# EAGLE schematic mbed_programmer (EAGLE 7.5.0)

## Sheet 1 of 4
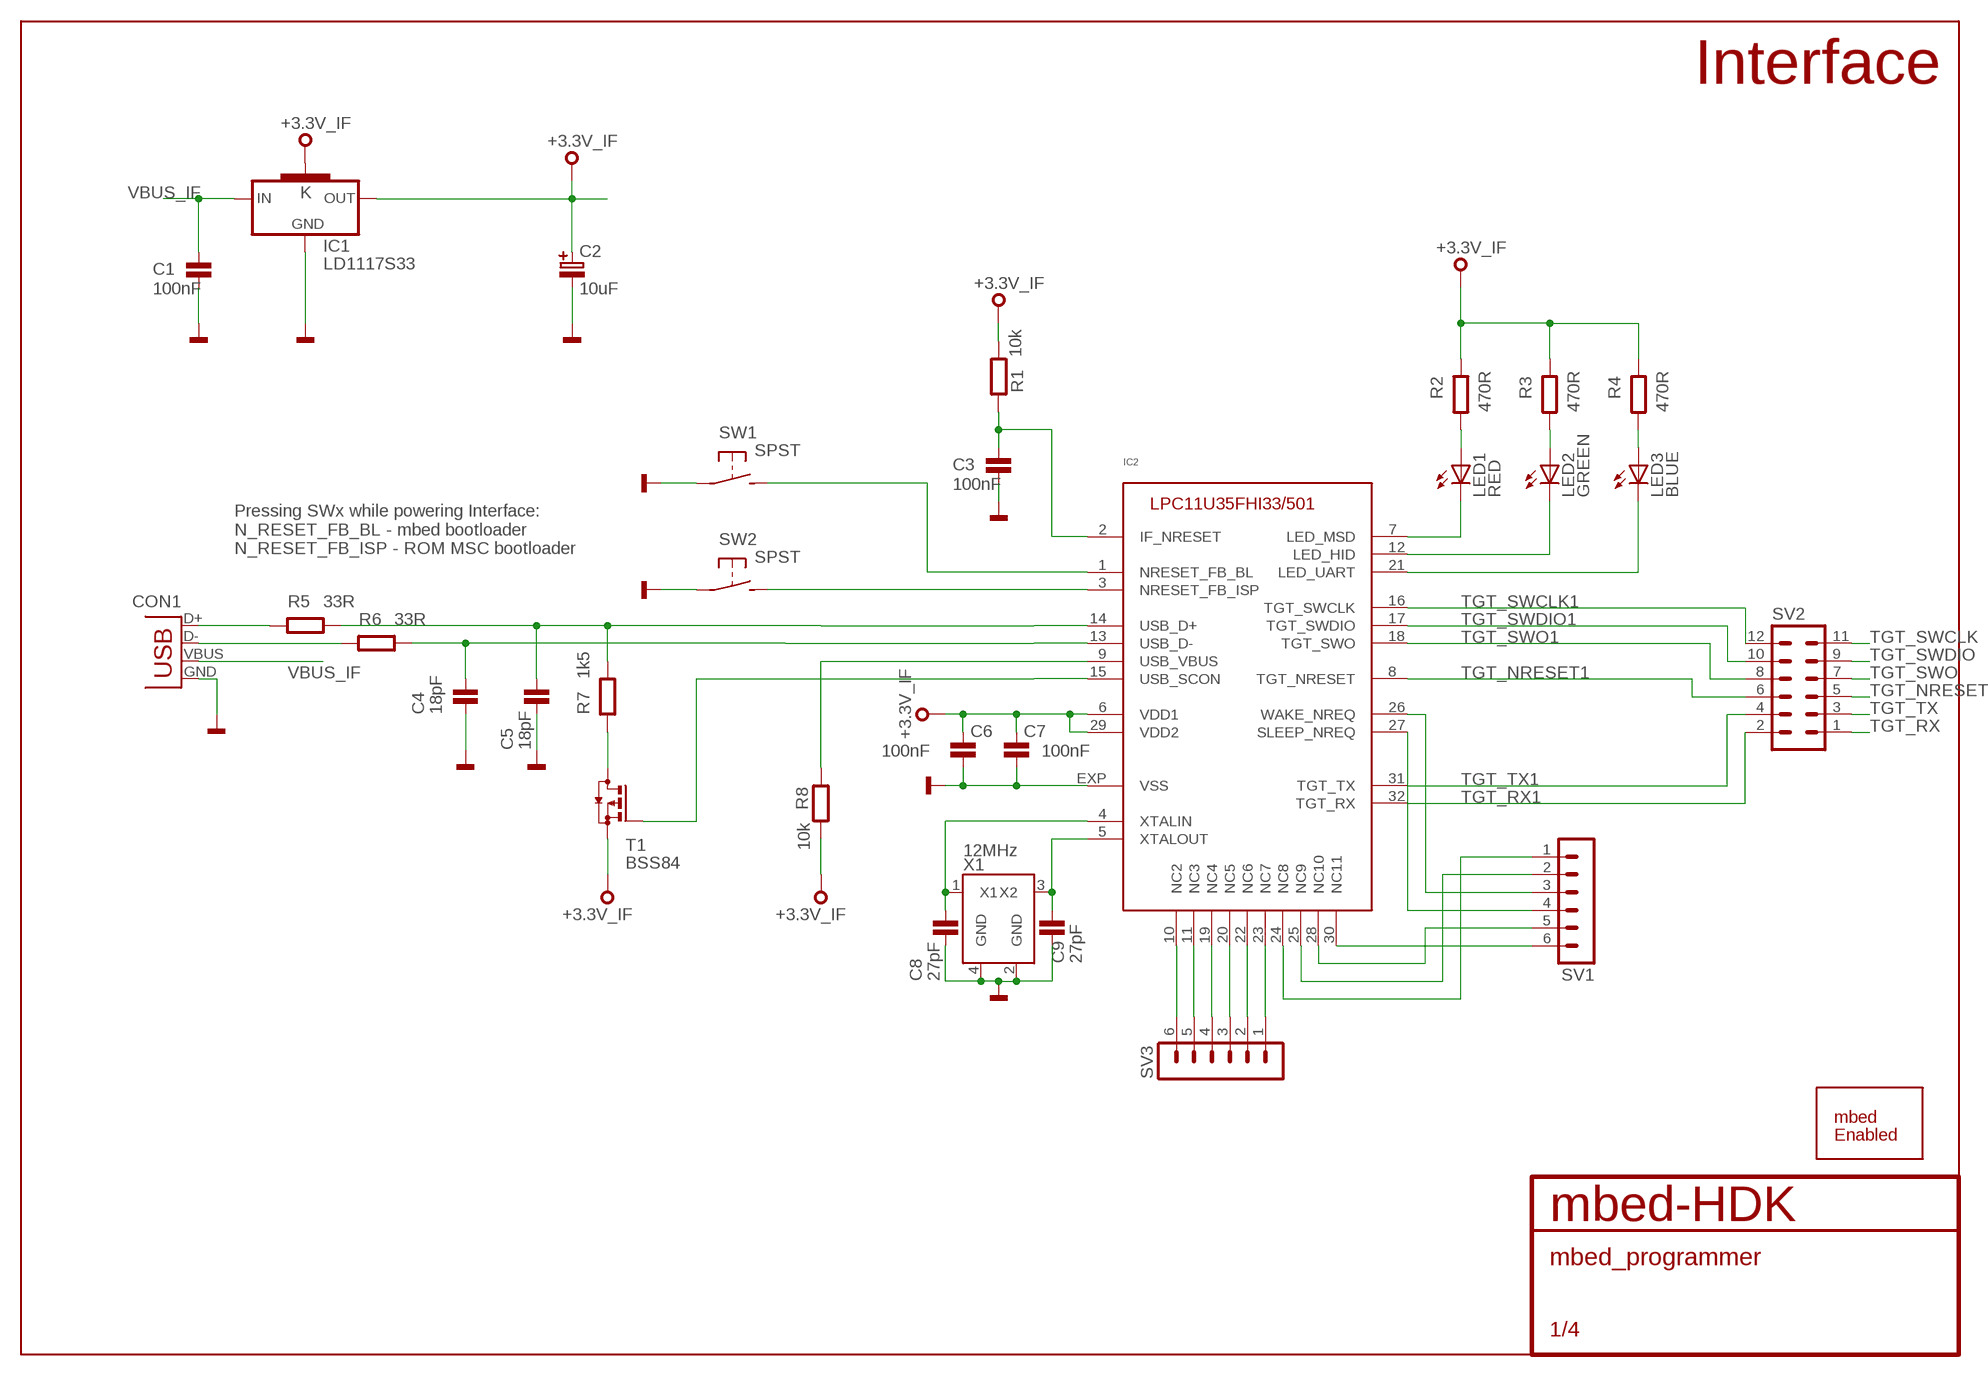
[diagram p0: schematic, sheet 1]

### Parts
C1  100nF  C0603  [0603]
C2  10uF  C-POLB  [CASE-B]
C3  100nF  C0603  [0603]
C4  18pF  C0603  [0603]
C5  18pF  C0603  [0603]
C6  100nF  C0603  [0603]
C7  100nF  C0603  [0603]
C8  27pF  C0603  [0603]
C9  27pF  C0603  [0603]
CON1  USB-MB-S  [USB-MB-S]
IC1  LD1117S33  [SOT223]
IC2  IF-LPC11U35  [HVQFN33]
LED1  RED  LED0603  [CHIPLED_0603]
LED2  GREEN  LED0603  [CHIPLED_0603]
LED3  BLUE  LED0603  [CHIPLED_0603]
R1  10k  R0603  [0603]
R2  470R  R0603  [0603]
R3  470R  R0603  [0603]
R4  470R  R0603  [0603]
R5  33R  R0603  [0603]
R6  33R  R0603  [0603]
R7  1k5  R0603  [0603]
R8  10k  R0603  [0603]
SS1  MBED-ENABLED-LOGOMEDIUM  [MBED-ENABLED-LOGO-500X500-MIL]
SV1  MA06-1  [MA06-1]
SV2  MA06-2  [MA06-2]
SV3  MA06-1  [MA06-1]
SW1  SPST  [DTSM-32S-B]
SW2  SPST  [DTSM-32S-B]
T1  BSS84  [SOT23]
X1  12MHz  ABM8  [OSC_CMD_32_25]

### Nets
+3.3V_IF: C2.1 C6.1 C7.1 IC1.2(OUT) IC1.4(K) IC2.6(VDD1) IC2.29(VDD2) R1.2 R2.1 R3.1 R4.1 R8.2 T1.2(S)
GND: C1.2 C2.2 C3.2 C4.2 C5.2 C6.2 C7.2 C8.2 C9.2 CON1.GND IC1.1(GND) IC2.EXP(VSS) SW1.P$1(P) SW2.P$1(P) X1.2(GND) X1.4(GND) ; also sheet 2,3
GREEN: IC2.12(LED_HID) LED2.C
GREEN1: IC2.7(LED_MSD) LED1.C
N$1: C5.1 IC2.14(USB_D+) R5.2 R7.2
N$2: C4.1 IC2.13(USB_D-) R6.2
N$3: CON1.D- R6.1
N$4: CON1.D+ R5.1
N$5: C3.1 IC2.2(IF_NRESET) R1.1
N$6: R7.1 T1.3(D)
N$7: IC2.9(USB_VBUS) R8.1
N$8: LED1.A R2.2
N$9: LED2.A R3.2
N$11: C8.1 IC2.4(XTALIN) X1.1(X1)
N$12: C9.1 IC2.5(XTALOUT) X1.3(X2)
N$13: IC2.21(LED_UART) LED3.C
N$15: IC2.1(NRESET_FB_BL) SW1.P$2(S)
N$17: IC2.3(NRESET_FB_ISP) SW2.P$2(S)
N$18: LED3.A R4.2
N$19: IC2.15(USB_SCON) T1.1(G)
N$79: IC2.30(NC11) SV1.6
N$80: IC2.28(NC10) SV1.5
N$81: IC2.27(SLEEP_NREQ) SV1.4
N$82: IC2.26(WAKE_NREQ) SV1.3
N$83: IC2.25(NC9) SV1.2
N$84: IC2.24(NC8) SV1.1
N$85: IC2.10(NC2) SV3.6
N$86: IC2.11(NC3) SV3.5
N$87: IC2.19(NC4) SV3.4
N$88: IC2.20(NC5) SV3.3
N$89: IC2.22(NC6) SV3.2
N$90: IC2.23(NC7) SV3.1
TGT_NRESET: SV2.5 ; also sheet 2
TGT_NRESET1: IC2.8(TGT_NRESET) SV2.6
TGT_RX: SV2.1 ; also sheet 2
TGT_RX1: IC2.32(TGT_RX) SV2.2
TGT_SWCLK: SV2.11 ; also sheet 2
TGT_SWCLK1: IC2.16(TGT_SWCLK) SV2.12
TGT_SWDIO: SV2.9 ; also sheet 2
TGT_SWDIO1: IC2.17(TGT_SWDIO) SV2.10
TGT_SWO: SV2.7 ; also sheet 2
TGT_SWO1: IC2.18(TGT_SWO) SV2.8
TGT_TX: SV2.3 ; also sheet 2
TGT_TX1: IC2.31(TGT_TX) SV2.4
VBUS_IF: C1.1 CON1.VBUS IC1.3(IN) ; also sheet 3

### Notes on the sheet
- Interface
- Pressing SWx while powering Interface:
  N_RESET_FB_BL - mbed bootloader
  N_RESET_FB_ISP - ROM MSC bootloader

## Sheet 2 of 4
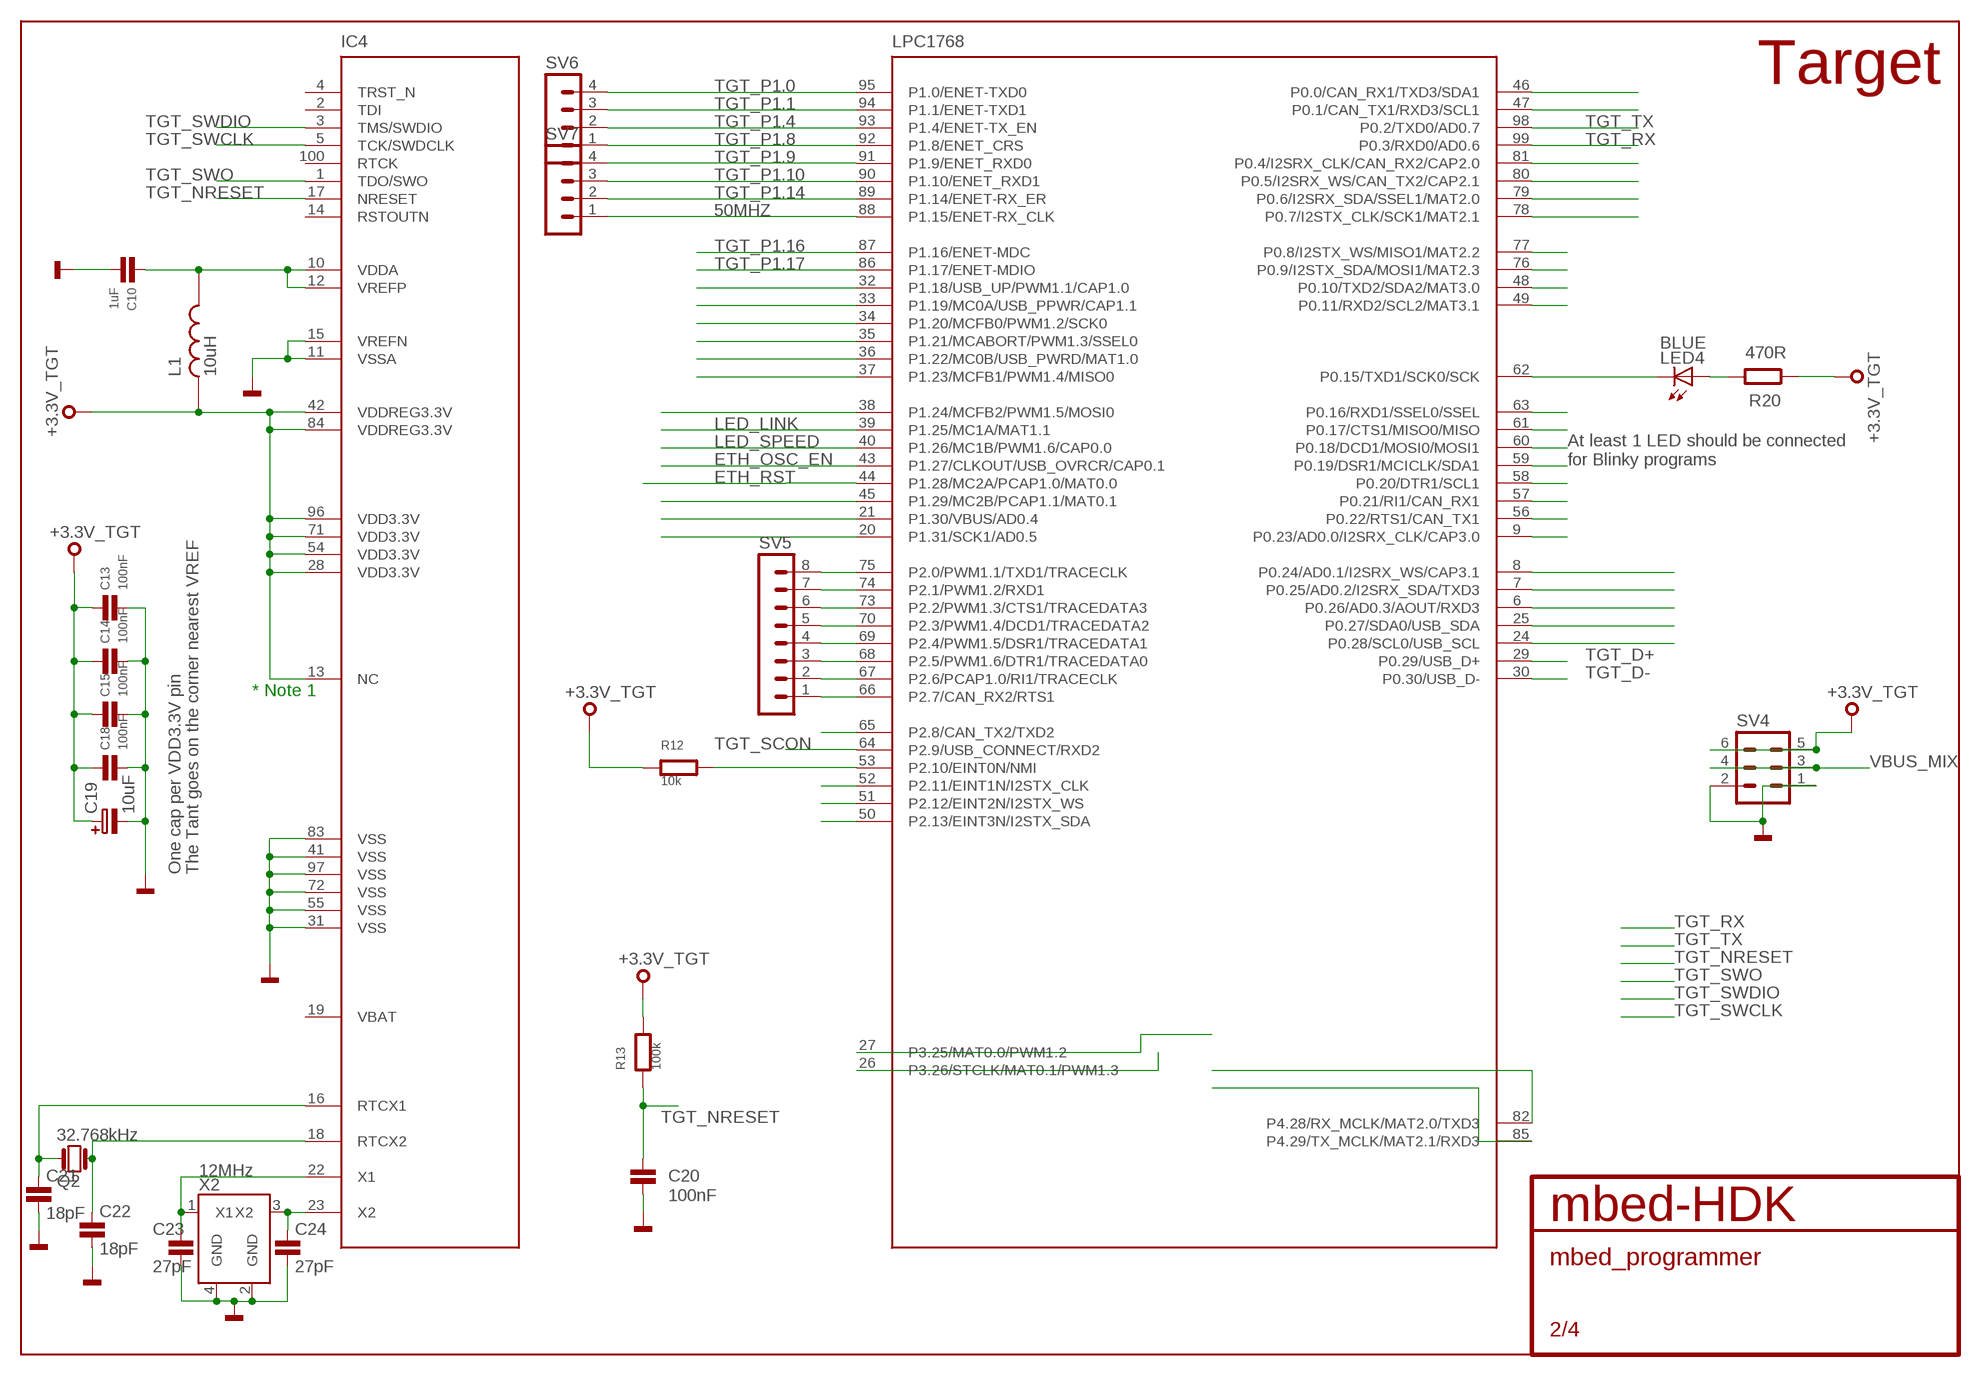
[diagram p1: schematic, sheet 2]

### Parts
C10  1uF  C0603  [0603]
C13  100nF  C0603  [0603]
C14  100nF  C0603  [0603]
C15  100nF  C0603  [0603]
C18  100nF  C0603  [0603]
C19  10uF  C-POLB  [CASE-B]
C20  100nF  C0603  [0603]
C21  18pF  C0603  [0603]
C22  18pF  C0603  [0603]
C23  27pF  C0603  [0603]
C24  27pF  C0603  [0603]
IC4  LPC1768  [LQFP100]
L1  10uH  L  [0603]
LED4  BLUE  LED0603  [CHIPLED_0603]
Q2  32.768kHz  Q_FC135  [FC135]
R12  10k  R0603  [0603]
R13  100k  R0603  [0603]
R20  470R  R0603  [0603]
SV4  MA03-2  [MA03-2]
SV5  MA08-1  [MA08-1]
SV6  MA04-1  [MA04-1]
SV7  MA04-1  [MA04-1]
X2  12MHz  ABM8  [OSC_CMD_32_25]

### Nets
50MHZ: IC4.88(P1.15/ENET-RX_CLK) SV7.1
+3.3V_TGT: C13.1 C14.1 C15.1 C18.1 C19.1 IC4.13(NC) IC4.28(VDD3.3V) IC4.42(VDDREG3.3V) IC4.54(VDD3.3V) IC4.71(VDD3.3V) IC4.84(VDDREG3.3V) IC4.96(VDD3.3V) L1.1 R12.1 R13.2 R20.1 SV4.5 SV4.6 ; also sheet 3
ETH_OSC_EN: IC4.43(P1.27/CLKOUT/USB_OVRCR/CAP0.1)
ETH_RST: IC4.44(P1.28/MC2A/PCAP1.0/MAT0.0)
GND: C10.2 C13.2 C14.2 C15.2 C18.2 C19.2 C20.1 C21.1 C22.1 C23.1 C24.1 IC4.11(VSSA) IC4.15(VREFN) IC4.31(VSS) IC4.41(VSS) IC4.55(VSS) IC4.72(VSS) IC4.83(VSS) IC4.97(VSS) SV4.1 SV4.2 X2.2(GND) X2.4(GND) ; also sheet 1,3
LED_LINK: IC4.39(P1.25/MC1A/MAT1.1)
LED_SPEED: IC4.40(P1.26/MC1B/PWM1.6/CAP0.0)
N$16: C10.1 IC4.10(VDDA) IC4.12(VREFP) L1.2
N$20: IC4.53(P2.10/EINT0N/NMI) R12.2
N$21: C23.2 IC4.22(X1) X2.1(X1)
N$23: C21.2 IC4.16(RTCX1) Q2.X2
N$24: C22.2 IC4.18(RTCX2) Q2.X1
N$25: IC4.62(P0.15/TXD1/SCK0/SCK) LED4.C
N$26: LED4.A R20.2
N$27: IC4.32(P1.18/USB_UP/PWM1.1/CAP1.0)
N$30: IC4.33(P1.19/MC0A/USB_PPWR/CAP1.1)
N$31: IC4.34(P1.20/MCFB0/PWM1.2/SCK0)
N$32: IC4.35(P1.21/MCABORT/PWM1.3/SSEL0)
N$33: IC4.36(P1.22/MC0B/USB_PWRD/MAT1.0)
N$34: IC4.37(P1.23/MCFB1/PWM1.4/MISO0)
N$35: IC4.38(P1.24/MCFB2/PWM1.5/MOSI0)
N$36: IC4.45(P1.29/MC2B/PCAP1.1/MAT0.1)
N$37: IC4.21(P1.30/VBUS/AD0.4)
N$38: IC4.20(P1.31/SCK1/AD0.5)
N$39: IC4.75(P2.0/PWM1.1/TXD1/TRACECLK) SV5.8
N$40: IC4.74(P2.1/PWM1.2/RXD1) SV5.7
N$41: IC4.73(P2.2/PWM1.3/CTS1/TRACEDATA3) SV5.6
N$42: IC4.70(P2.3/PWM1.4/DCD1/TRACEDATA2) SV5.5
N$43: IC4.69(P2.4/PWM1.5/DSR1/TRACEDATA1) SV5.4
N$44: IC4.68(P2.5/PWM1.6/DTR1/TRACEDATA0) SV5.3
N$45: IC4.67(P2.6/PCAP1.0/RI1/TRACECLK) SV5.2
N$46: IC4.66(P2.7/CAN_RX2/RTS1) SV5.1
N$47: IC4.65(P2.8/CAN_TX2/TXD2)
N$48: IC4.52(P2.11/EINT1N/I2STX_CLK)
N$49: IC4.51(P2.12/EINT2N/I2STX_WS)
N$50: IC4.50(P2.13/EINT3N/I2STX_SDA)
N$51: IC4.27(P3.25/MAT0.0/PWM1.2)
N$52: IC4.26(P3.26/STCLK/MAT0.1/PWM1.3)
N$53: IC4.82(P4.28/RX_MCLK/MAT2.0/TXD3)
N$54: IC4.85(P4.29/TX_MCLK/MAT2.1/RXD3)
N$55: IC4.24(P0.28/SCL0/USB_SCL)
N$56: IC4.25(P0.27/SDA0/USB_SDA)
N$57: IC4.6(P0.26/AD0.3/AOUT/RXD3)
N$58: IC4.7(P0.25/AD0.2/I2SRX_SDA/TXD3)
N$59: IC4.8(P0.24/AD0.1/I2SRX_WS/CAP3.1)
N$60: IC4.9(P0.23/AD0.0/I2SRX_CLK/CAP3.0)
N$61: IC4.56(P0.22/RTS1/CAN_TX1)
N$62: IC4.57(P0.21/RI1/CAN_RX1)
N$63: IC4.58(P0.20/DTR1/SCL1)
N$64: IC4.59(P0.19/DSR1/MCICLK/SDA1)
N$65: IC4.60(P0.18/DCD1/MOSI0/MOSI1)
N$66: IC4.61(P0.17/CTS1/MISO0/MISO)
N$67: IC4.63(P0.16/RXD1/SSEL0/SSEL)
N$68: IC4.49(P0.11/RXD2/SCL2/MAT3.1)
N$69: IC4.48(P0.10/TXD2/SDA2/MAT3.0)
N$70: IC4.76(P0.9/I2STX_SDA/MOSI1/MAT2.3)
N$71: IC4.77(P0.8/I2STX_WS/MISO1/MAT2.2)
N$72: IC4.78(P0.7/I2STX_CLK/SCK1/MAT2.1)
N$73: IC4.79(P0.6/I2SRX_SDA/SSEL1/MAT2.0)
N$74: IC4.80(P0.5/I2SRX_WS/CAN_TX2/CAP2.1)
N$75: IC4.81(P0.4/I2SRX_CLK/CAN_RX2/CAP2.0)
N$76: IC4.47(P0.1/CAN_TX1/RXD3/SCL1)
N$77: IC4.46(P0.0/CAN_RX1/TXD3/SDA1)
N$78: C24.2 IC4.23(X2) X2.3(X2)
TGT_D+: IC4.29(P0.29/USB_D+) ; also sheet 3
TGT_D-: IC4.30(P0.30/USB_D-) ; also sheet 3
TGT_NRESET: C20.2 IC4.17(NRESET) R13.1 ; also sheet 1
TGT_P1.0: IC4.95(P1.0/ENET-TXD0) SV6.4
TGT_P1.1: IC4.94(P1.1/ENET-TXD1) SV6.3
TGT_P1.4: IC4.93(P1.4/ENET-TX_EN) SV6.2
TGT_P1.8: IC4.92(P1.8/ENET_CRS) SV6.1
TGT_P1.9: IC4.91(P1.9/ENET_RXD0) SV7.4
TGT_P1.10: IC4.90(P1.10/ENET_RXD1) SV7.3
TGT_P1.14: IC4.89(P1.14/ENET-RX_ER) SV7.2
TGT_P1.16: IC4.87(P1.16/ENET-MDC)
TGT_P1.17: IC4.86(P1.17/ENET-MDIO)
TGT_RX: IC4.99(P0.3/RXD0/AD0.6) ; also sheet 1
TGT_SCON: IC4.64(P2.9/USB_CONNECT/RXD2) ; also sheet 3
TGT_SWCLK: IC4.5(TCK/SWDCLK) ; also sheet 1
TGT_SWDIO: IC4.3(TMS/SWDIO) ; also sheet 1
TGT_SWO: IC4.1(TDO/SWO) ; also sheet 1
TGT_TX: IC4.98(P0.2/TXD0/AD0.7) ; also sheet 1
VBUS_MIX: SV4.3 SV4.4 ; also sheet 3
Unconnected: IC4.2(TDI) IC4.4(TRST_N) IC4.14(RSTOUTN) IC4.19(VBAT) IC4.100(RTCK)

### Notes on the sheet
- Target
- At least 1 LED should be connected
  for Blinky programs
- * Note 1
- One cap per VDD3.3V pin | The Tant goes on the corner nearest VREF

## Sheet 3 of 4
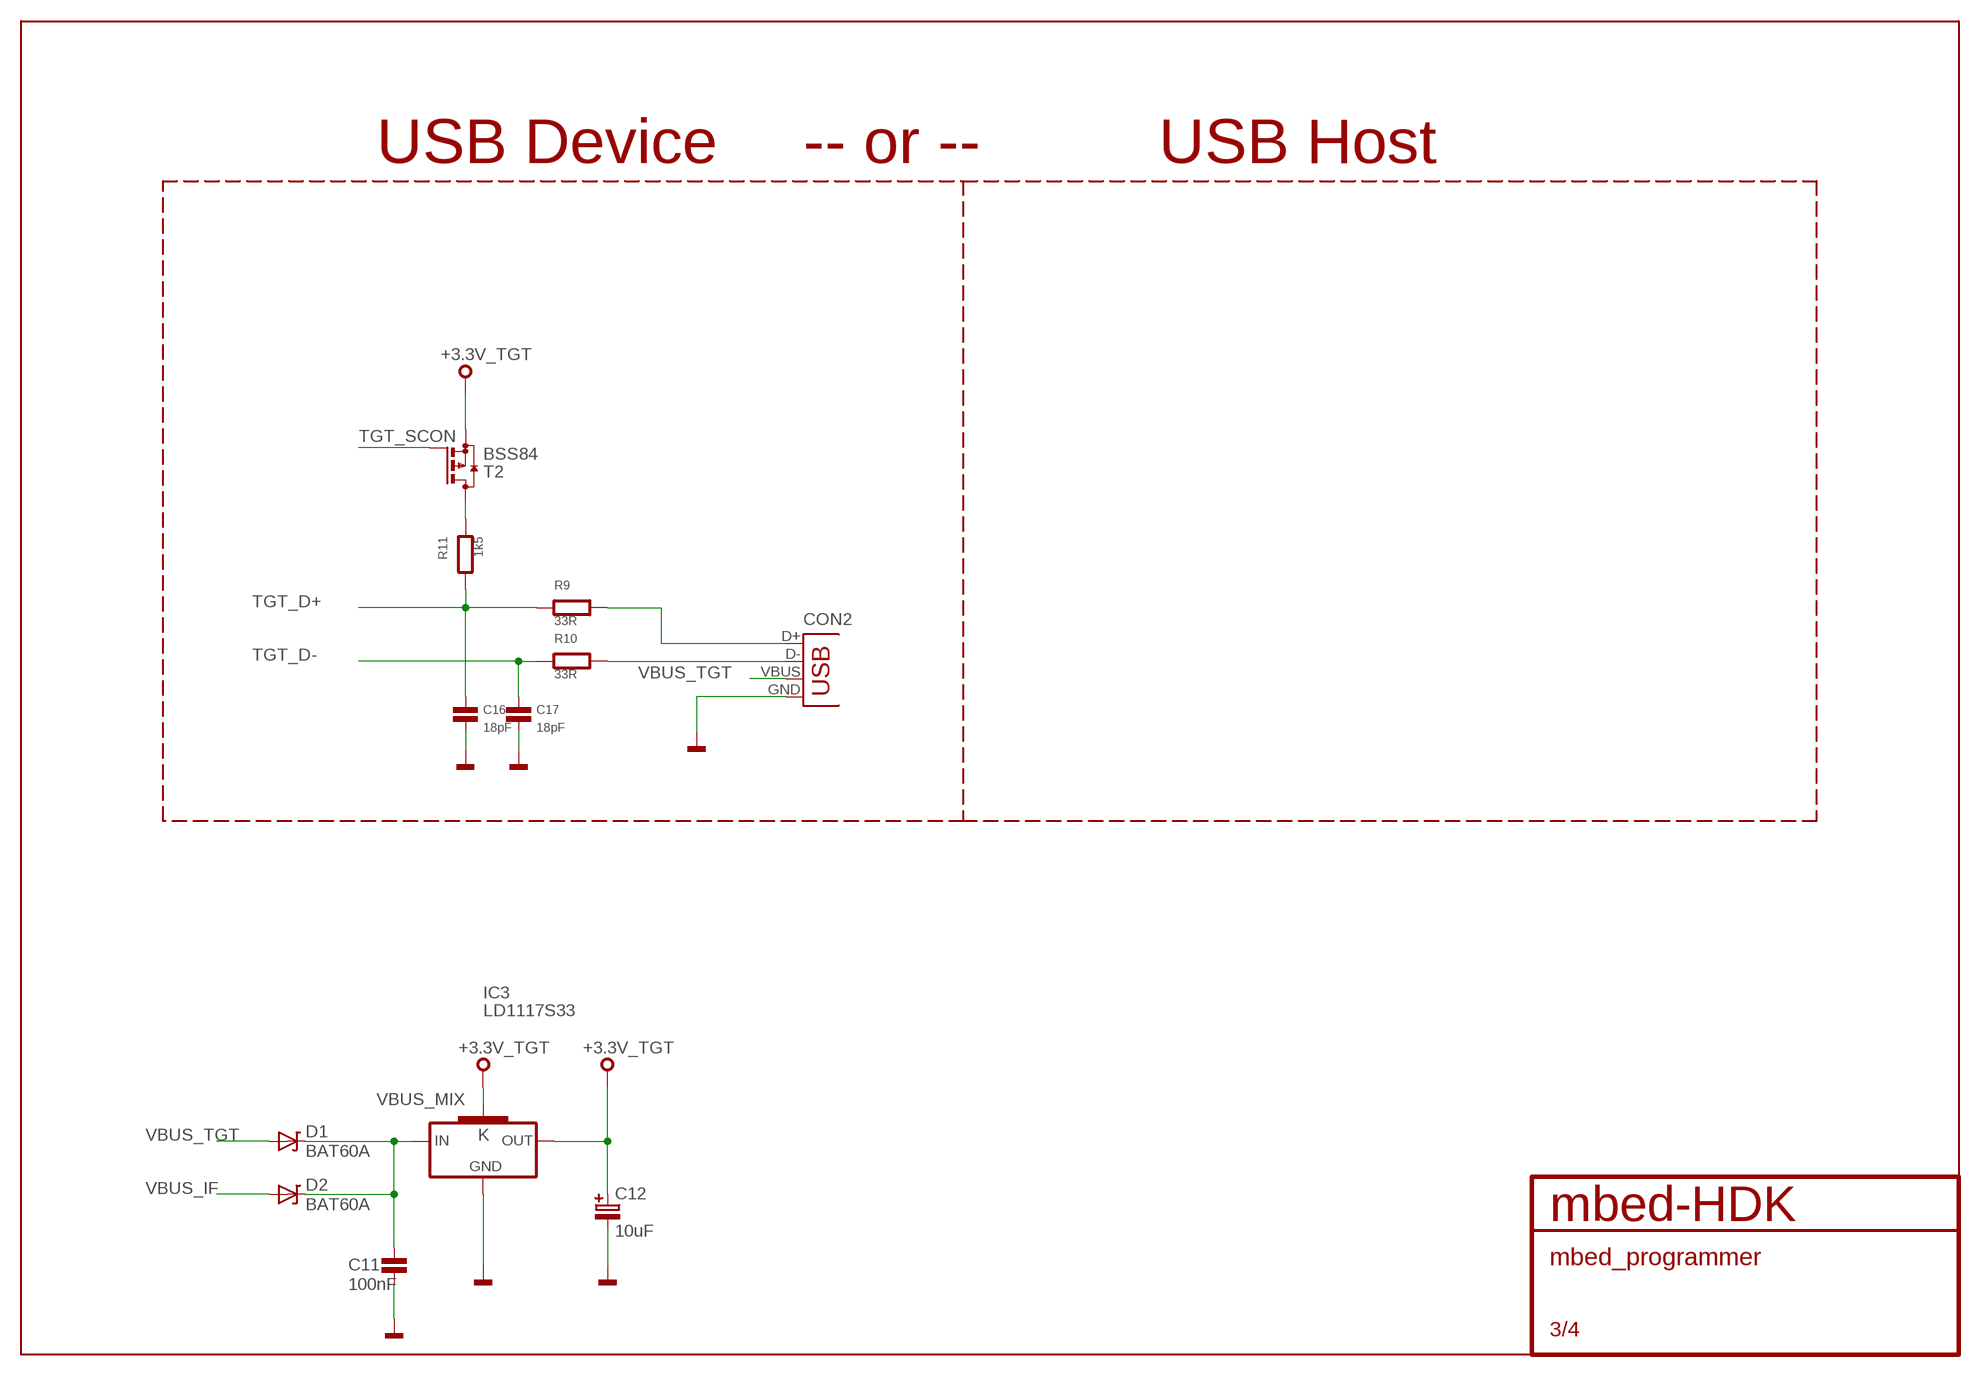
[diagram p2: schematic, sheet 3]

### Parts
C11  100nF  C0603  [0603]
C12  10uF  C-POLB  [CASE-B]
C16  18pF  C0603  [0603]
C17  18pF  C0603  [0603]
CON2  USB-MB-S  [USB-MB-S]
D1  BAT60A  [BAT60A]
D2  BAT60A  [BAT60A]
IC3  LD1117S33  [SOT223]
R9  33R  R0603  [0603]
R10  33R  R0603  [0603]
R11  1k5  R0603  [0603]
T2  BSS84  [SOT23]

### Nets
+3.3V_TGT: C12.1 IC3.2(OUT) IC3.4(K) T2.2(S) ; also sheet 2
GND: C11.2 C12.2 C16.2 C17.2 CON2.GND IC3.1(GND) ; also sheet 1,2
N$14: R11.1 T2.3(D)
N$28: CON2.D- R10.2
N$29: CON2.D+ R9.2
TGT_D+: C16.1 R9.1 R11.2 ; also sheet 2
TGT_D-: C17.1 R10.1 ; also sheet 2
TGT_SCON: T2.1(G) ; also sheet 2
VBUS_IF: D2.A ; also sheet 1
VBUS_MIX: C11.1 D1.K D2.K IC3.3(IN) ; also sheet 2
VBUS_TGT: CON2.VBUS D1.A

### Notes on the sheet
- USB Device | -- or -- | USB Host

## Sheet 4 of 4
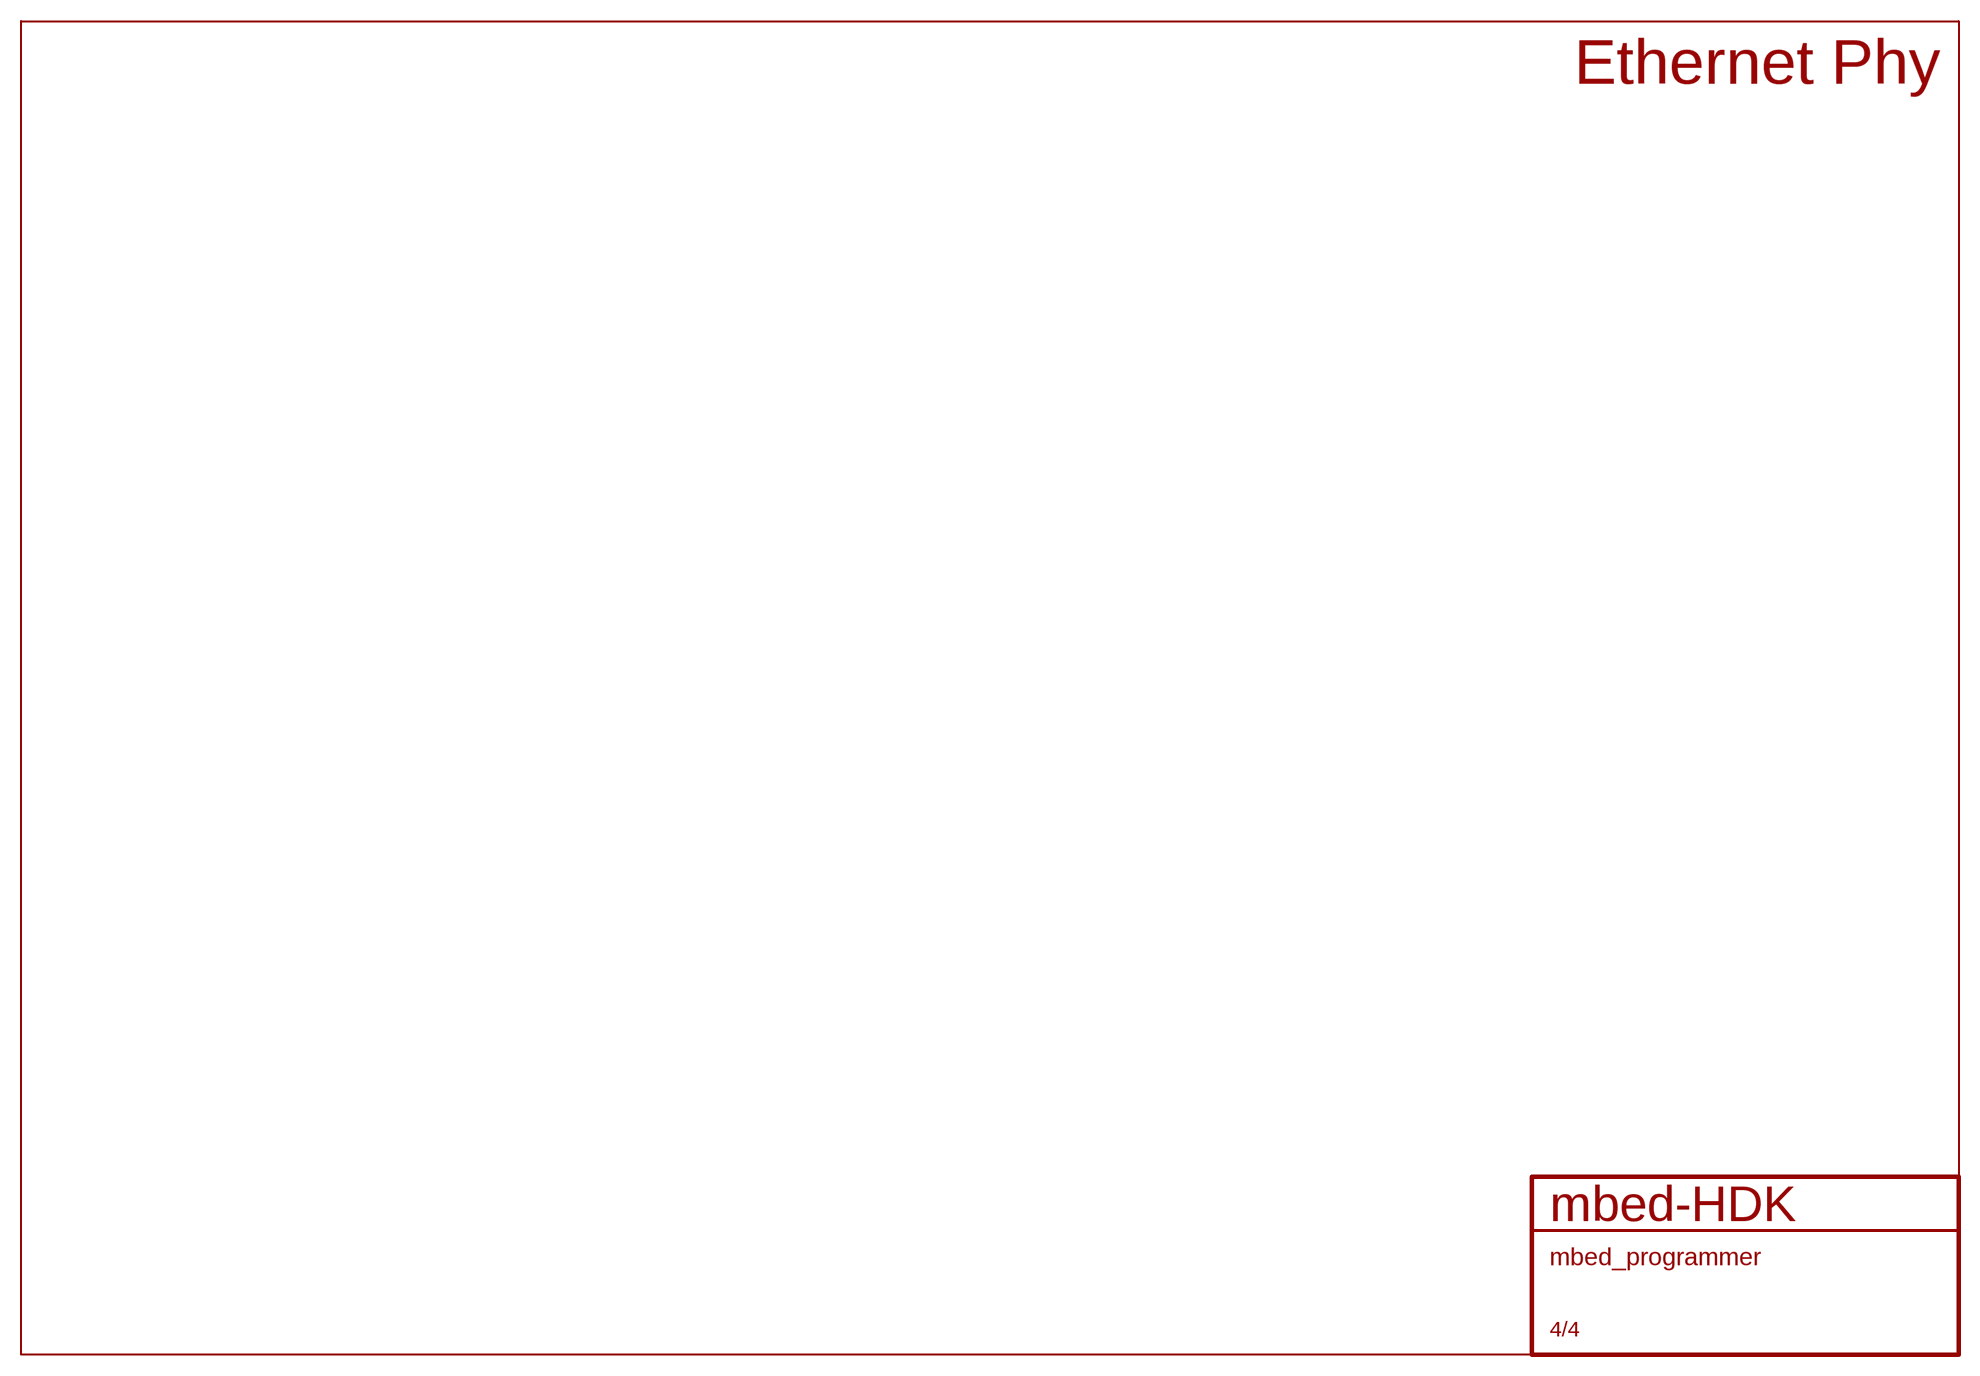
[diagram p3: schematic, sheet 4]

### Notes on the sheet
- Ethernet Phy

## Library data of the parts
C1 C3-C11 C13-C18 C20-C24 = mbed-HDK:C
C2 C12 C19 = mbed-HDK:C-POL
CON1 CON2 = mbed-HDK:USB: USB Connectors
D1 D2 = mbed-HDK:BAT60A
IC1 IC3 = mbed-HDK:LD1117S33: VOLTAGE REGULATOR SMD 3,3V
IC2 = mbed-HDK:IF-LPC11U35
IC4 = mbed-HDK:LPC1768
L1 = mbed-HDK:L
LED1-LED4 = mbed-HDK:LED
Q2 = mbed-HDK:Q
R1-R13 R20 = mbed-HDK:R
SS1 = mbed-HDK:MBED-ENABLED-LOGO
SV1 SV3 = con-lstb:MA06-1: PIN HEADER; OC_FARNELL: unknown; OC_NEWARK: unknown
SV2 = con-lstb:MA06-2: PIN HEADER; OC_FARNELL: unknown; OC_NEWARK: unknown
SV4 = con-lstb:MA03-2: PIN HEADER; OC_FARNELL: unknown; OC_NEWARK: unknown
SV5 = con-lstb:MA08-1: PIN HEADER; OC_FARNELL: unknown; OC_NEWARK: unknown
SV6 SV7 = con-lstb:MA04-1: PIN HEADER; OC_FARNELL: unknown; OC_NEWARK: unknown
SW1 SW2 = mbed-HDK:SPST
T1 T2 = mbed-HDK:BSS84: P-CHANNEL MOS FET
X1 X2 = crystals_oscillators:ABM8

## Net classes
0 default: width 0.152 mm, drill 0.305 mm, clearance 0.152 mm